# EAGLE design bob-spark-shield (EAGLE 7.0.0)
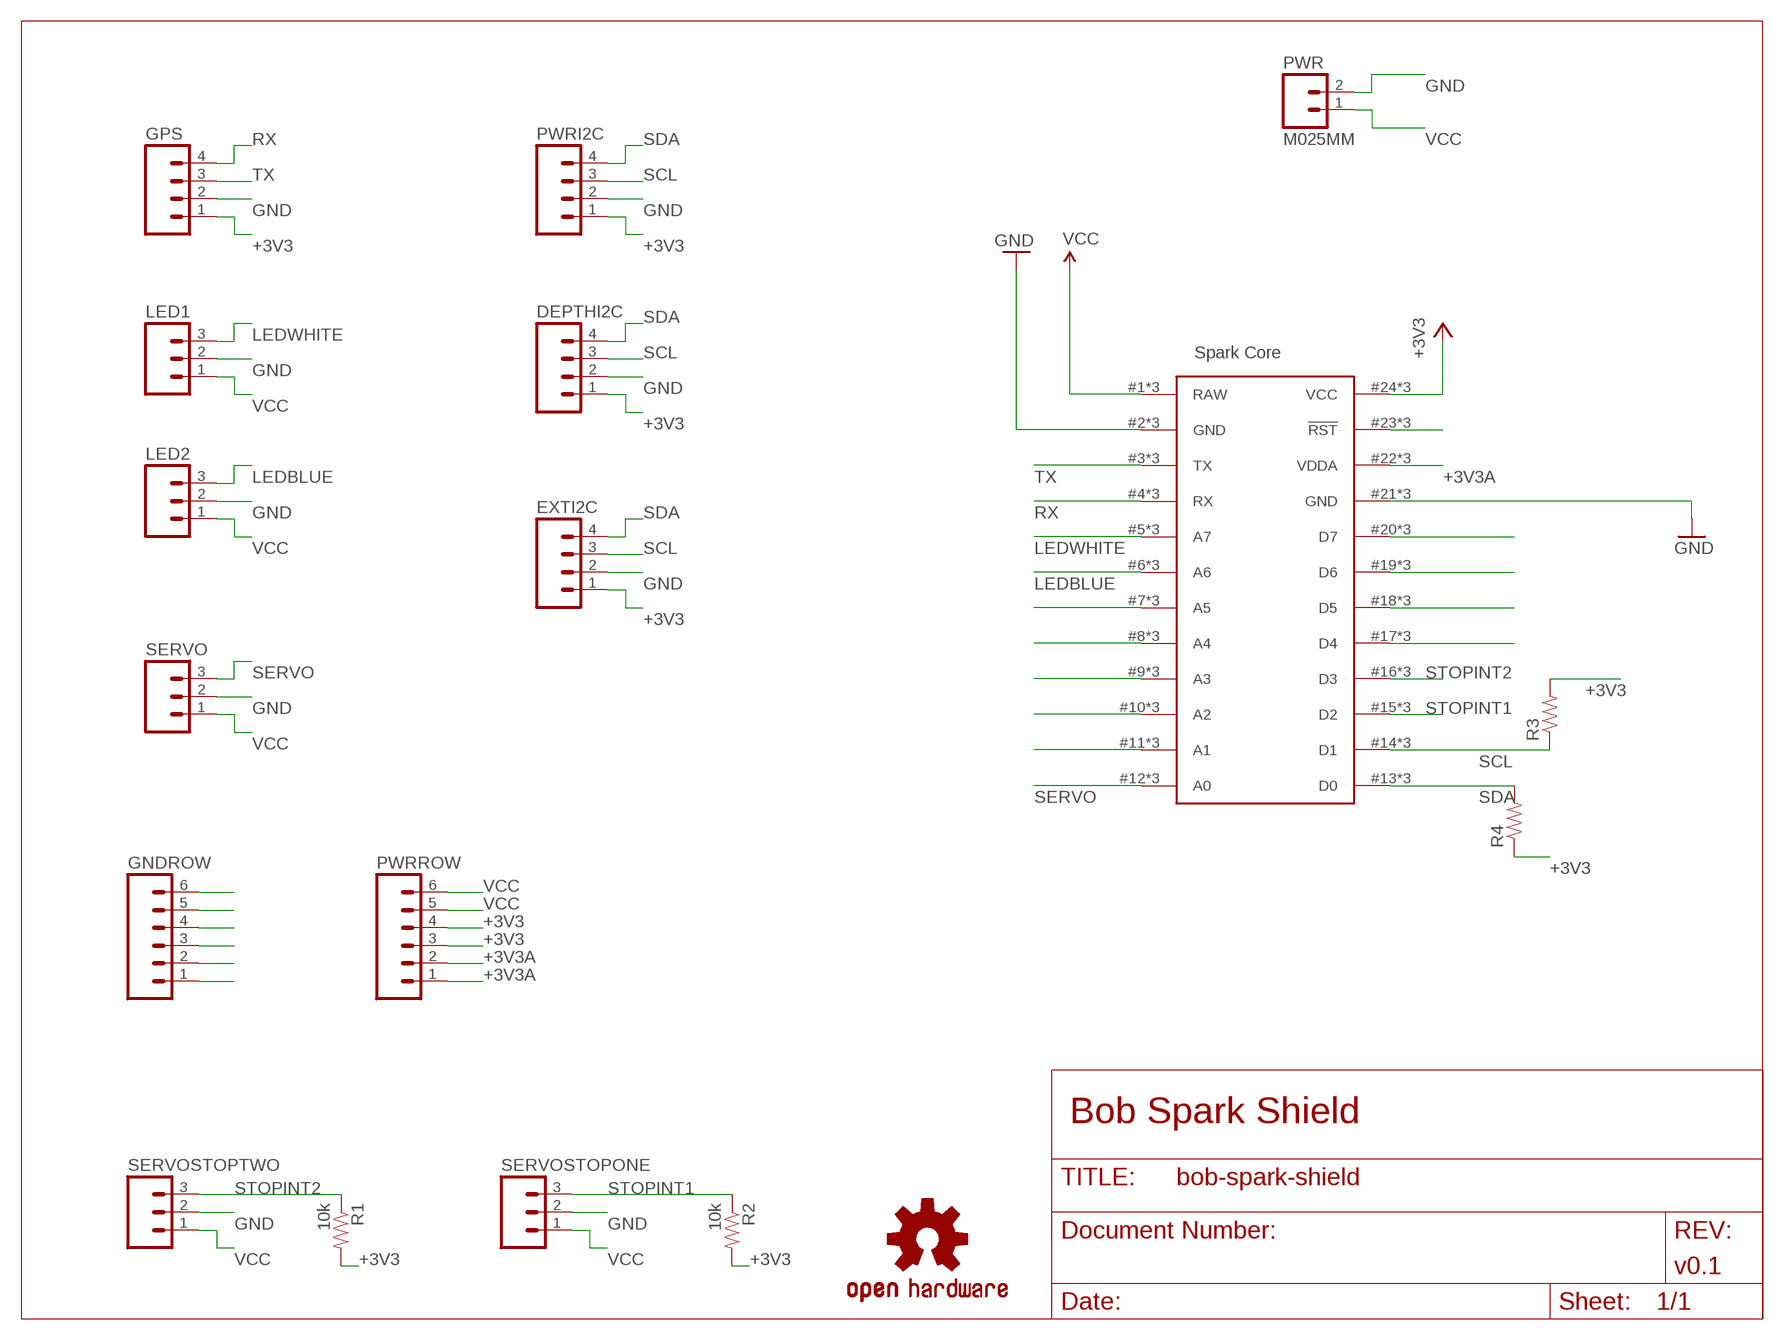
[diagram p0: schematic, sheet 1]

## Parts
DEPTHI2C  M04LOCK  [1X04_LOCK]
EXTI2C  M04LOCK  [1X04_LOCK]
GNDROW  M06LOCK  [1X06_LOCK]
GPS  M04LOCK  [1X04_LOCK]
LED1  M03LOCK  [1X03_LOCK]
LED2  M03LOCK  [1X03_LOCK]
LOGO1  OSHW-LOGOM  [OSHW-LOGO-M]
PWR  M025MM  [SCREWTERMINAL-5MM-2]
PWRI2C  M04LOCK  [1X04_LOCK]
PWRROW  M06LOCK  [1X06_LOCK]
R1  10k  RESISTOR0805-RES  [0805]
R2  10k  RESISTOR0805-RES  [0805]
R3  RESISTOR0805-RES  [0805]
R4  RESISTOR0805-RES  [0805]
SERVO  M03LOCK  [1X03_LOCK]
SERVOSTOPONE  M03LOCK  [1X03_LOCK]
SERVOSTOPTWO  M03LOCK  [1X03_LOCK]
U$1  SPARK_CORE  [SPARK_CORE_STACKABLE]

## Nets
+3V3: DEPTHI2C.1 EXTI2C.1 GPS.1 PWRI2C.1 PWRROW.3 PWRROW.4 R1.2 R2.2 R3.2 R4.1 U$1.24(VCC) U$1.#24(VCC) U$1.@24(VCC)
+3V3A: PWRROW.1 PWRROW.2 U$1.22(VDDA) U$1.#22(VDDA) U$1.@22(VDDA)
GND: DEPTHI2C.2 EXTI2C.2 GNDROW.1 GNDROW.2 GNDROW.3 GNDROW.4 GNDROW.5 GNDROW.6 GPS.2 LED1.2 LED2.2 PWR.2 PWRI2C.2 SERVO.2 SERVOSTOPONE.2 SERVOSTOPTWO.2 U$1.2(GND) U$1.21(GND) U$1.#2(GND) U$1.#21(GND) U$1.@2(GND) U$1.@21(GND)
LEDBLUE: LED2.3 U$1.6(A6) U$1.#6(A6) U$1.@6(A6)
LEDWHITE: LED1.3 U$1.5(A7) U$1.#5(A7) U$1.@5(A7)
N$1: U$1.11(A1) U$1.#11(A1) U$1.@11(A1)
N$2: U$1.10(A2) U$1.#10(A2) U$1.@10(A2)
N$3: U$1.9(A3) U$1.#9(A3) U$1.@9(A3)
N$4: U$1.8(A4) U$1.#8(A4) U$1.@8(A4)
N$5: U$1.7(A5) U$1.#7(A5) U$1.@7(A5)
N$6: U$1.18(D5) U$1.#18(D5) U$1.@18(D5)
N$7: U$1.17(D4) U$1.#17(D4) U$1.@17(D4)
N$8: U$1.19(D6) U$1.#19(D6) U$1.@19(D6)
N$9: U$1.20(D7) U$1.#20(D7) U$1.@20(D7)
N$10: U$1.23(!RST) U$1.#23(!RST) U$1.@23(!RST)
RX: GPS.4 U$1.4(RX) U$1.#4(RX) U$1.@4(RX)
SCL: DEPTHI2C.3 EXTI2C.3 PWRI2C.3 R3.1 U$1.14(D1) U$1.#14(D1) U$1.@14(D1)
SDA: DEPTHI2C.4 EXTI2C.4 PWRI2C.4 R4.2 U$1.13(D0) U$1.#13(D0) U$1.@13(D0)
SERVO: SERVO.3 U$1.12(A0) U$1.#12(A0) U$1.@12(A0)
STOPINT1: R2.1 SERVOSTOPONE.3 U$1.15(D2) U$1.#15(D2) U$1.@15(D2)
STOPINT2: R1.1 SERVOSTOPTWO.3 U$1.16(D3) U$1.#16(D3) U$1.@16(D3)
TX: GPS.3 U$1.3(TX) U$1.#3(TX) U$1.@3(TX)
VCC: LED1.1 LED2.1 PWR.1 PWRROW.5 PWRROW.6 SERVO.1 SERVOSTOPONE.1 SERVOSTOPTWO.1 U$1.1(RAW) U$1.#1(RAW) U$1.@1(RAW)

## Notes on the sheet
- Spark Core
- Bob Spark Shield
- v0.1

## Library data of the parts
DEPTHI2C EXTI2C GPS PWRI2C = SparkFun-Connectors:M04: Header 4 Standard 4-pin 0.1" header. Use with straight break away headers (SKU : PRT-00116), right angle break away headers (PRT-00553), swiss pins (PRT-00743), machine pins (PRT-00117), and female headers (PRT-00115). Molex polarized connector foot print use with SKU : PRT-08231 with associated crimp pins and housings. 1MM SMD Version SKU: PRT-10208
GNDROW PWRROW = SparkFun-Connectors:M06: Header 6 Standard 6-pin 0.1" header. Use with straight break away headers (SKU : PRT-00116), right angle break away headers (PRT-00553), swiss pins (PRT-00743), machine pins (PRT-00117), and female headers (PRT-00115). Molex polarized connector foot print use with SKU : PRT-08094 with associated crimp pins and housings. NOTES ON THE VARIANTS LOCK and LOCK_LONGPADS... This footprint was designed to help hold the alignment of a through-hole component (i.e. 6-pin header) while soldering it into place. You may notice that each hole has been shifted either up or down by 0.005 of an inch from it's more standard position (which is a perfectly straight line). This slight alteration caused the pins (the squares in the middle) to touch the edges of the holes. Because they are alternating, it causes a "brace" to hold the component in place. 0.005 has proven to be the perfect amount of "off-center" position when using our standard breakaway headers. Although looks a little odd when you look at the bare footprint, once you have a header in there, the alteration is very hard to notice. Also,if you push a header all the way into place, it is covered up entirely on the bottom side. This idea of altering the position of holes to aid alignment will be further integrated into the Sparkfun Library for other footprints. It can help hold any component with 3 or more connection pins.
LED1 LED2 SERVO SERVOSTOPONE SERVOSTOPTWO = SparkFun-Connectors:M03: Header 3 Standard 3-pin 0.1" header. Use with straight break away headers (SKU : PRT-00116), right angle break away headers (PRT-00553), swiss pins (PRT-00743), machine pins (PRT-00117), and female headers (PRT-00115). Molex polarized connector foot print use with SKU : PRT-08232 with associated crimp pins and housings.
LOGO1 = Spark:OSHW-LOGO: Open Source Hardware Logo This logo indicates the piece of hardware it is found on incorporates a OSHW license and/or adheres to the definition of open source hardware found here: http://freedomdefined.org/OSHW
PWR = SparkFun-Connectors:M02: Standard 2-pin 0.1" header. Use with - straight break away headers ( PRT-00116) - right angle break away headers (PRT-00553) - swiss pins (PRT-00743) - machine pins (PRT-00117) - female headers (PRT-00115) Molex polarized connector foot print use with: PRT-08233 with associated crimp pins and housings. 2.54_SCREWTERM for use with PRT-10571. 3.5mm Screw Terminal footprints for PRT-08084 5mm Screw Terminal footprints for use with PRT-08433
R1-R4 = SparkFun-Passives:RESISTOR: Resistor Basic schematic elements and footprints for 0603, 1206, and PTH resistors.
U$1 = Spark:SPARK_CORE

## Board
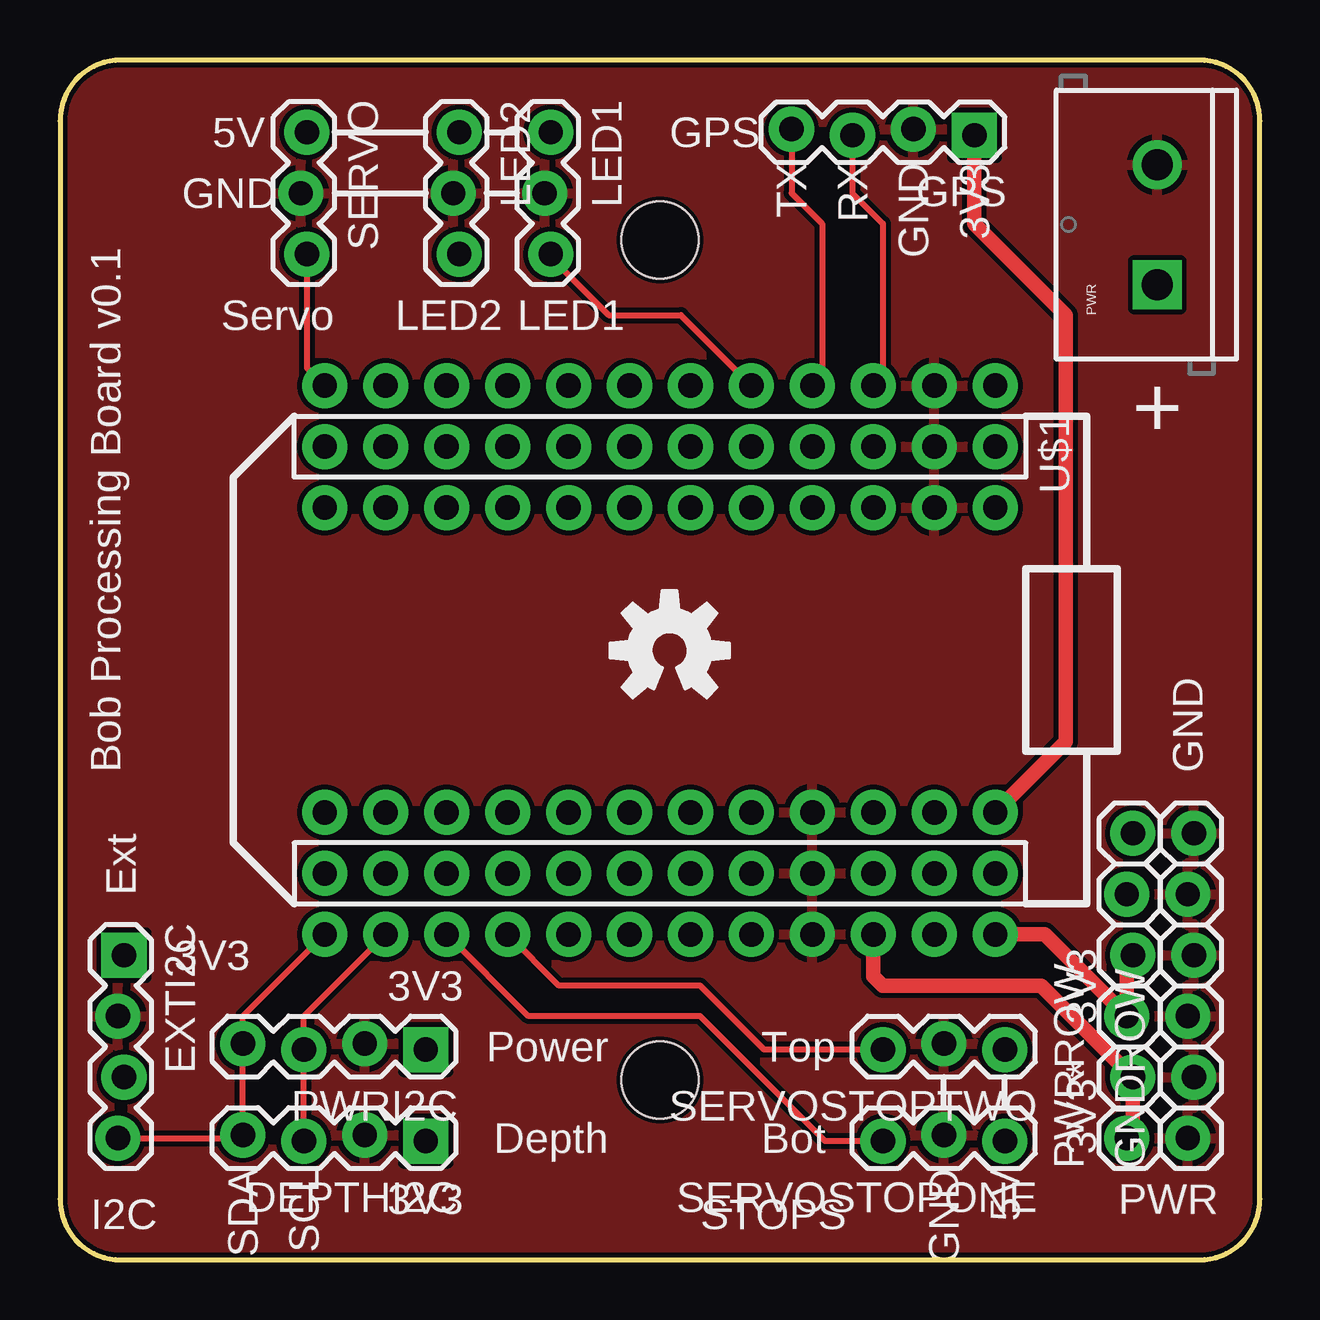
[diagram p1: board, top side]
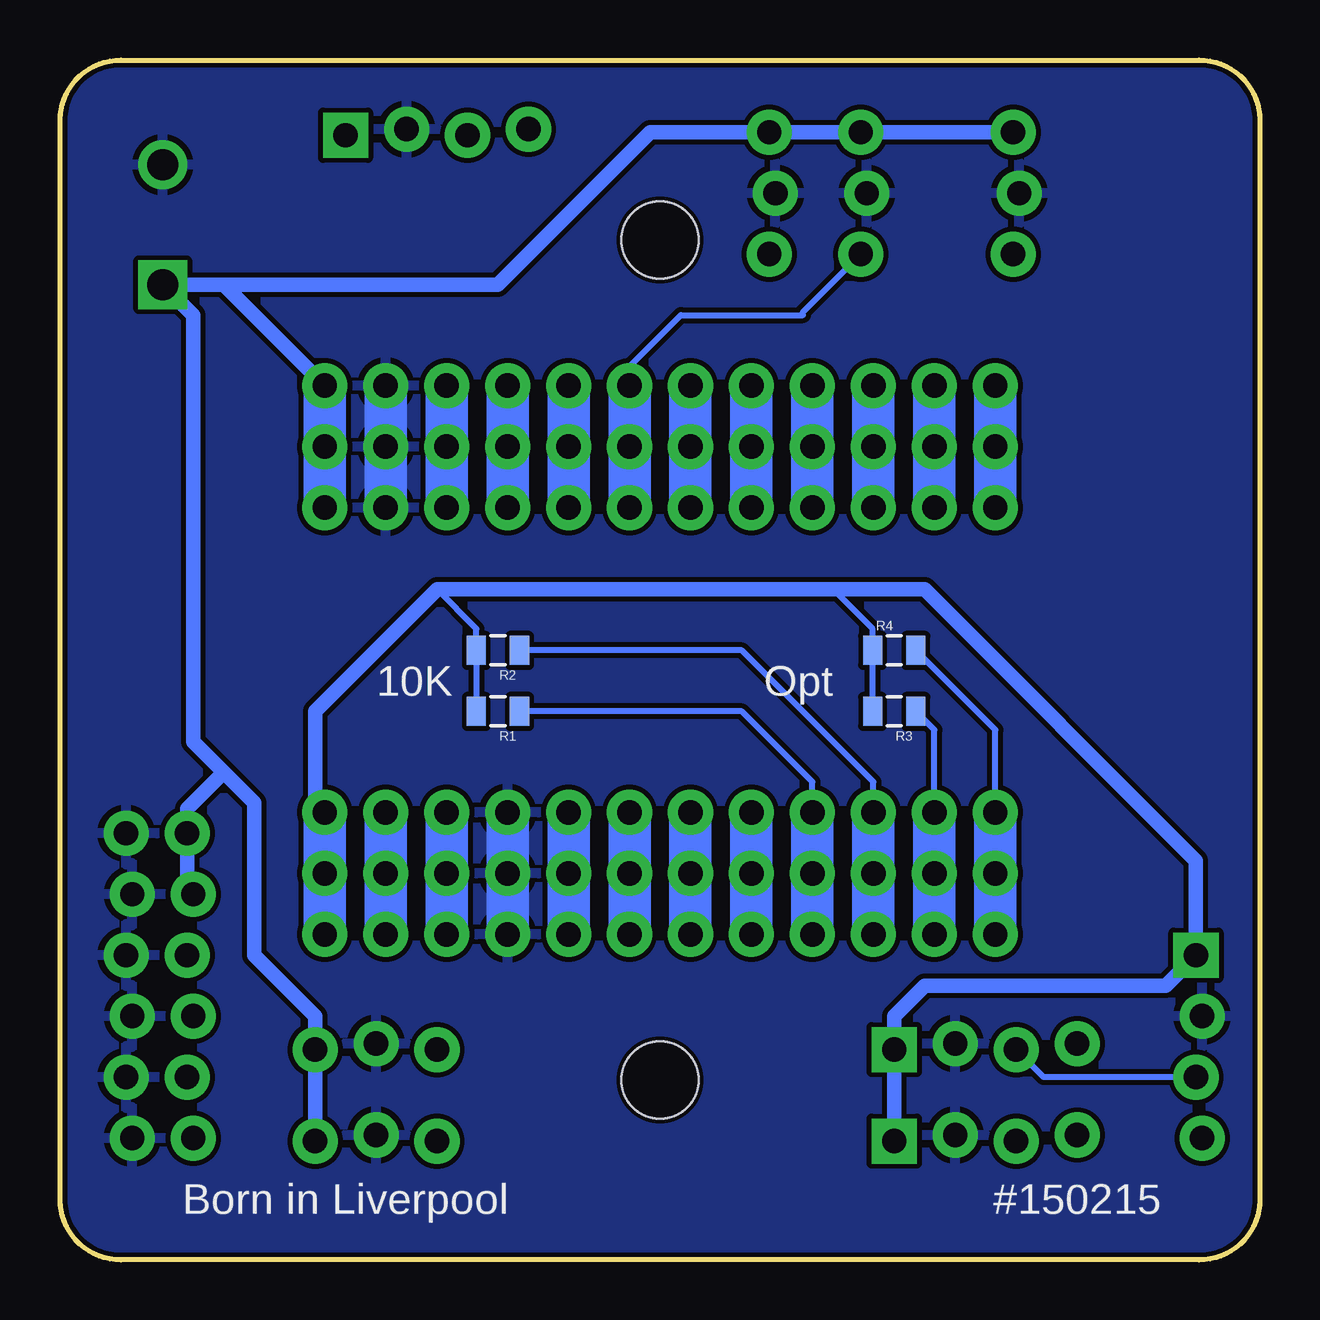
[diagram p2: board, bottom side, seen from below]

Size 50 x 50 mm. Coordinates in mm from the lower left corner, seen from the top.
Outline: 50,2.54 50,47.46 arc90 47.46,50 2.54,50 arc90 0,47.46 0,2.54 arc90 2.54,0 47.46,0 arc90 50,2.54
Copper layers (1*16): Top 0.035mm / dielectric 1.5mm / Bottom 0.035mm
Design rules "SparkFun-2-layer": minimum track width 7mil, minimum drill 15mil, track to track 8mil, track to pad 8mil, pad to pad 8mil, via to via 8mil, smd to smd 8mil, copper to edge 8mil, drill to drill 8mil, minimum pad ring 12mil, minimum via ring 10mil, stop-mask expansion 4mil, vias tented up to drill 20mil, thermal gap 10mil
Holes 3.2 mm at 25,7.5 25,42.5

### Footprints (pad centres in the part's own frame; a part is rotated, then mirrored left to right if it is on the bottom)
1X04_LOCK = drill 1.016 pad 1.88 square: 1 0,0.127 | drill 1.016 pad 1.88: 2 2.54,-0.127; 3 5.08,0.127; 4 7.62,-0.127
1X06_LOCK = drill 1.016 pad 1.88: 1 0,0; 2 2.54,-0.254; 3 5.08,0; 4 7.62,-0.254; 5 10.16,0; 6 12.7,-0.254
1X03_LOCK = drill 1.016 pad 1.88: 1 0,0.127; 2 2.54,-0.127; 3 5.08,0.127
SCREWTERMINAL-5MM-2 = drill 1.3 pad 2.032 square: 1 0,0 | drill 1.3 pad 2.032: 2 5,0
0805 = smd 0.8 x 1.2: 1 -0.9,0; 2 0.9,0
SPARK_CORE_STACKABLE = drill 1.016 pad 1.88: 1 -8.89,13.97; 2 -8.89,11.43; 3 -8.89,8.89; 4 -8.89,6.35; 5 -8.89,3.81; 6 -8.89,1.27; 7 -8.89,-1.27; 8 -8.89,-3.81; 9 -8.89,-6.35; 10 -8.89,-8.89; 11 -8.89,-11.43; 12 -8.89,-13.97; 13 8.89,-13.97; 14 8.89,-11.43; 15 8.89,-8.89; 16 8.89,-6.35; 17 8.89,-3.81; 18 8.89,-1.27; 19 8.89,1.27; 20 8.89,3.81; 21 8.89,6.35; 22 8.89,8.89; 23 8.89,11.43; 24 8.89,13.97; #1 -6.35,13.97; #2 -6.35,11.43; #3 -6.35,8.89; #4 -6.35,6.35; #5 -6.35,3.81; #6 -6.35,1.27; #7 -6.35,-1.27; #8 -6.35,-3.81; #9 -6.35,-6.35; #10 -6.35,-8.89; #11 -6.35,-11.43; #12 -6.35,-13.97; #13 11.43,-13.97; #14 11.43,-11.43; #15 11.43,-8.89; #16 11.43,-6.35; #17 11.43,-3.81; #18 11.43,-1.27; #19 11.43,1.27; #20 11.43,3.81; #21 11.43,6.35; #22 11.43,8.89; #23 11.43,11.43; #24 11.43,13.97; @1 -11.43,13.97; @2 -11.43,11.43; @3 -11.43,8.89; @4 -11.43,6.35; @5 -11.43,3.81; @6 -11.43,1.27; @7 -11.43,-1.27; @8 -11.43,-3.81; @9 -11.43,-6.35; @10 -11.43,-8.89; @11 -11.43,-11.43; @12 -11.43,-13.97; @13 6.35,-13.97; @14 6.35,-11.43; @15 6.35,-8.89; @16 6.35,-6.35; @17 6.35,-3.81; @18 6.35,-1.27; @19 6.35,1.27; @20 6.35,3.81; @21 6.35,6.35; @22 6.35,8.89; @23 6.35,11.43; @24 6.35,13.97

### Placement (x,y rotation side)
DEPTHI2C  15.24,5.08 180 top
EXTI2C  2.54,12.7 270 top
GNDROW  46.99,5.08 90 top
GPS  38.1,46.99 180 top
LED1  20.32,46.99 270 top
LED2  16.51,46.99 270 top
LOGO1  25.4,25.4 0 top
PWR  45.72,40.64 90 top
PWRI2C  15.24,8.89 180 top
PWRROW  44.45,5.08 90 top
R1  31.75,22.86 180 bottom
R2  31.75,25.4 180 bottom
R3  15.24,22.86 180 bottom
R4  15.24,25.4 0 bottom
SERVO  10.16,46.99 270 top
SERVOSTOPONE  39.37,5.08 180 top
SERVOSTOPTWO  39.37,8.89 180 top
U$1  25,25 270 top

### Tracks (layer width: path | path; a pad name or v marks a point on that pad's centre or on a via)
+3V3
  Top 0.61: GPS.1 38.1,43.18 41.91,39.37 41.91,21.59 U$1.@24 | U$1.#24 41.04,13.57 PWRROW.3 44.45,12.45 PWRROW.4
  Bottom 0.254: R3.2 R4.1 16.14,26.3 17.78,27.94 | R1.2 R2.2 32.65,26.3 34.29,27.94
  Bottom 0.61: U$1.@24 39.37,19.05 39.37,22.86 34.29,27.94 17.78,27.94 13.97,27.94 2.67,16.64 EXTI2C.1 3.94,11.43 13.97,11.43 15.24,10.16 PWRI2C.1 DEPTHI2C.1
  Bottom 1.778: U$1.@24 U$1.24 U$1.#24
+3V3A
  Top 0.61: U$1.#22 33.89,11.83 34.29,11.43 40.89,11.43 PWRROW.2 44.7,5.33 PWRROW.1
  Bottom 1.778: U$1.@22 U$1.22 U$1.#22
GND
  Bottom 1.778: U$1.@21 U$1.21 U$1.#21 | U$1.@2 U$1.2 U$1.#2
  pour Top: 0,2.54 0,47.46 arc-90 2.54,50 47.46,50 arc-90 50,47.46 50,2.54 arc-90 47.46,0 2.54,0 arc-90
  pour Bottom: 0,2.54 0,47.46 arc-90 2.54,50 47.46,50 arc-90 50,47.46 50,2.54 arc-90 47.46,0 2.54,0 arc-90
LEDBLUE
  Bottom 0.254: 16.64,41.78 LED2.3 19.05,39.5 19.05,39.37 24.13,39.37 26.27,37.23 U$1.@6
  Bottom 1.778: U$1.@6 U$1.6 U$1.#6
LEDWHITE
  Top 0.254: LED1.3 20.45,41.78 22.86,39.37 25.87,39.37 U$1.@5
  Bottom 1.778: U$1.@5 U$1.5 U$1.#5
N$1
  Bottom 1.778: U$1.@11 U$1.11 U$1.#11
N$2
  Bottom 1.778: U$1.@10 U$1.10 U$1.#10
N$3
  Bottom 1.778: U$1.@9 U$1.9 U$1.#9
N$4
  Bottom 1.778: U$1.@8 U$1.8 U$1.#8
N$5
  Bottom 1.778: U$1.@7 U$1.7 U$1.#7
N$6
  Bottom 1.778: U$1.@18 U$1.18 U$1.#18
N$7
  Bottom 1.778: U$1.@17 U$1.17 U$1.#17
N$8
  Bottom 1.778: U$1.@19 U$1.19 U$1.#19
N$9
  Bottom 1.778: U$1.@20 U$1.20 U$1.#20
N$10
  Bottom 1.778: U$1.@23 U$1.23 U$1.#23
RX
  Top 0.254: GPS.4 30.48,44.45 31.75,43.18 31.75,36.83 U$1.@4
  Bottom 1.778: U$1.@4 U$1.4 U$1.#4
SCL
  Top 0.254: U$1.#14 10.16,10.16 PWRI2C.3 DEPTHI2C.3
  Bottom 0.254: U$1.@14 13.57,22.09 R3.1 | EXTI2C.3 9.02,7.62 PWRI2C.3
  Bottom 1.778: U$1.#14 U$1.14 U$1.@14
SDA
  Top 0.254: U$1.#13 7.62,10.16 PWRI2C.4 DEPTHI2C.4 7.49,5.08 EXTI2C.4
  Bottom 0.254: U$1.@13 11.03,22.09 R4.2
  Bottom 1.778: U$1.#13 U$1.13 U$1.@13
SERVO
  Top 0.254: SERVO.3 10.29,37.17 U$1.@12
  Bottom 1.778: U$1.@12 U$1.12 U$1.#12
STOPINT1
  Top 0.254: SERVOSTOPONE.3 31.88,4.95 26.67,10.16 19.52,10.16 U$1.#15
  Bottom 0.254: U$1.@15 16.11,19.92 21.59,25.4 R2.1
  Bottom 1.778: U$1.@15 U$1.15 U$1.#15
STOPINT2
  Top 0.254: SERVOSTOPTWO.3 29.34,8.76 26.67,11.43 20.79,11.43 U$1.#16
  Bottom 0.254: U$1.@16 18.65,19.92 21.59,22.86 R1.1
  Bottom 1.778: U$1.@16 U$1.16 U$1.#16
TX
  Top 0.254: GPS.3 33.02,44.45 34.29,43.18 34.29,36.83 U$1.@3
  Bottom 1.778: U$1.#3 U$1.3 U$1.@3
VCC
  Bottom 0.61: PWR.1 31.75,40.64 25.4,46.99 LED1.1 LED2.1 SERVO.1 | PWRROW.5 44.7,15.49 PWRROW.6 44.7,18.8 43.18,20.32 | PWR.1 43.18,40.64 U$1.@1 | 43.18,20.32 41.91,19.05 41.91,12.7 39.37,10.16 SERVOSTOPTWO.1 SERVOSTOPONE.1 | 43.18,20.32 44.45,21.59 44.45,39.37 PWR.1
  Bottom 1.778: U$1.@1 U$1.1 U$1.#1

### Text on the board
tPlace: 5V | GPS | TX | RX | GND | 3V3 | GND | Servo | LED2 | LED1 | + | Bob Processing Board v0.1 | GND | Ext | 3V3 | 3V3 | 3V3 | Power | Top | 3V3* | Depth | Bot | SDA | SCL | GND | 5V | 3V3 | PWR | I2C | STOPS
bPlace: Opt | 10K | #150215 | Born in Liverpool